# EasyEDA Pro project ProProject_ESP32-Gateway_2023-11-02.epro, board PCB1
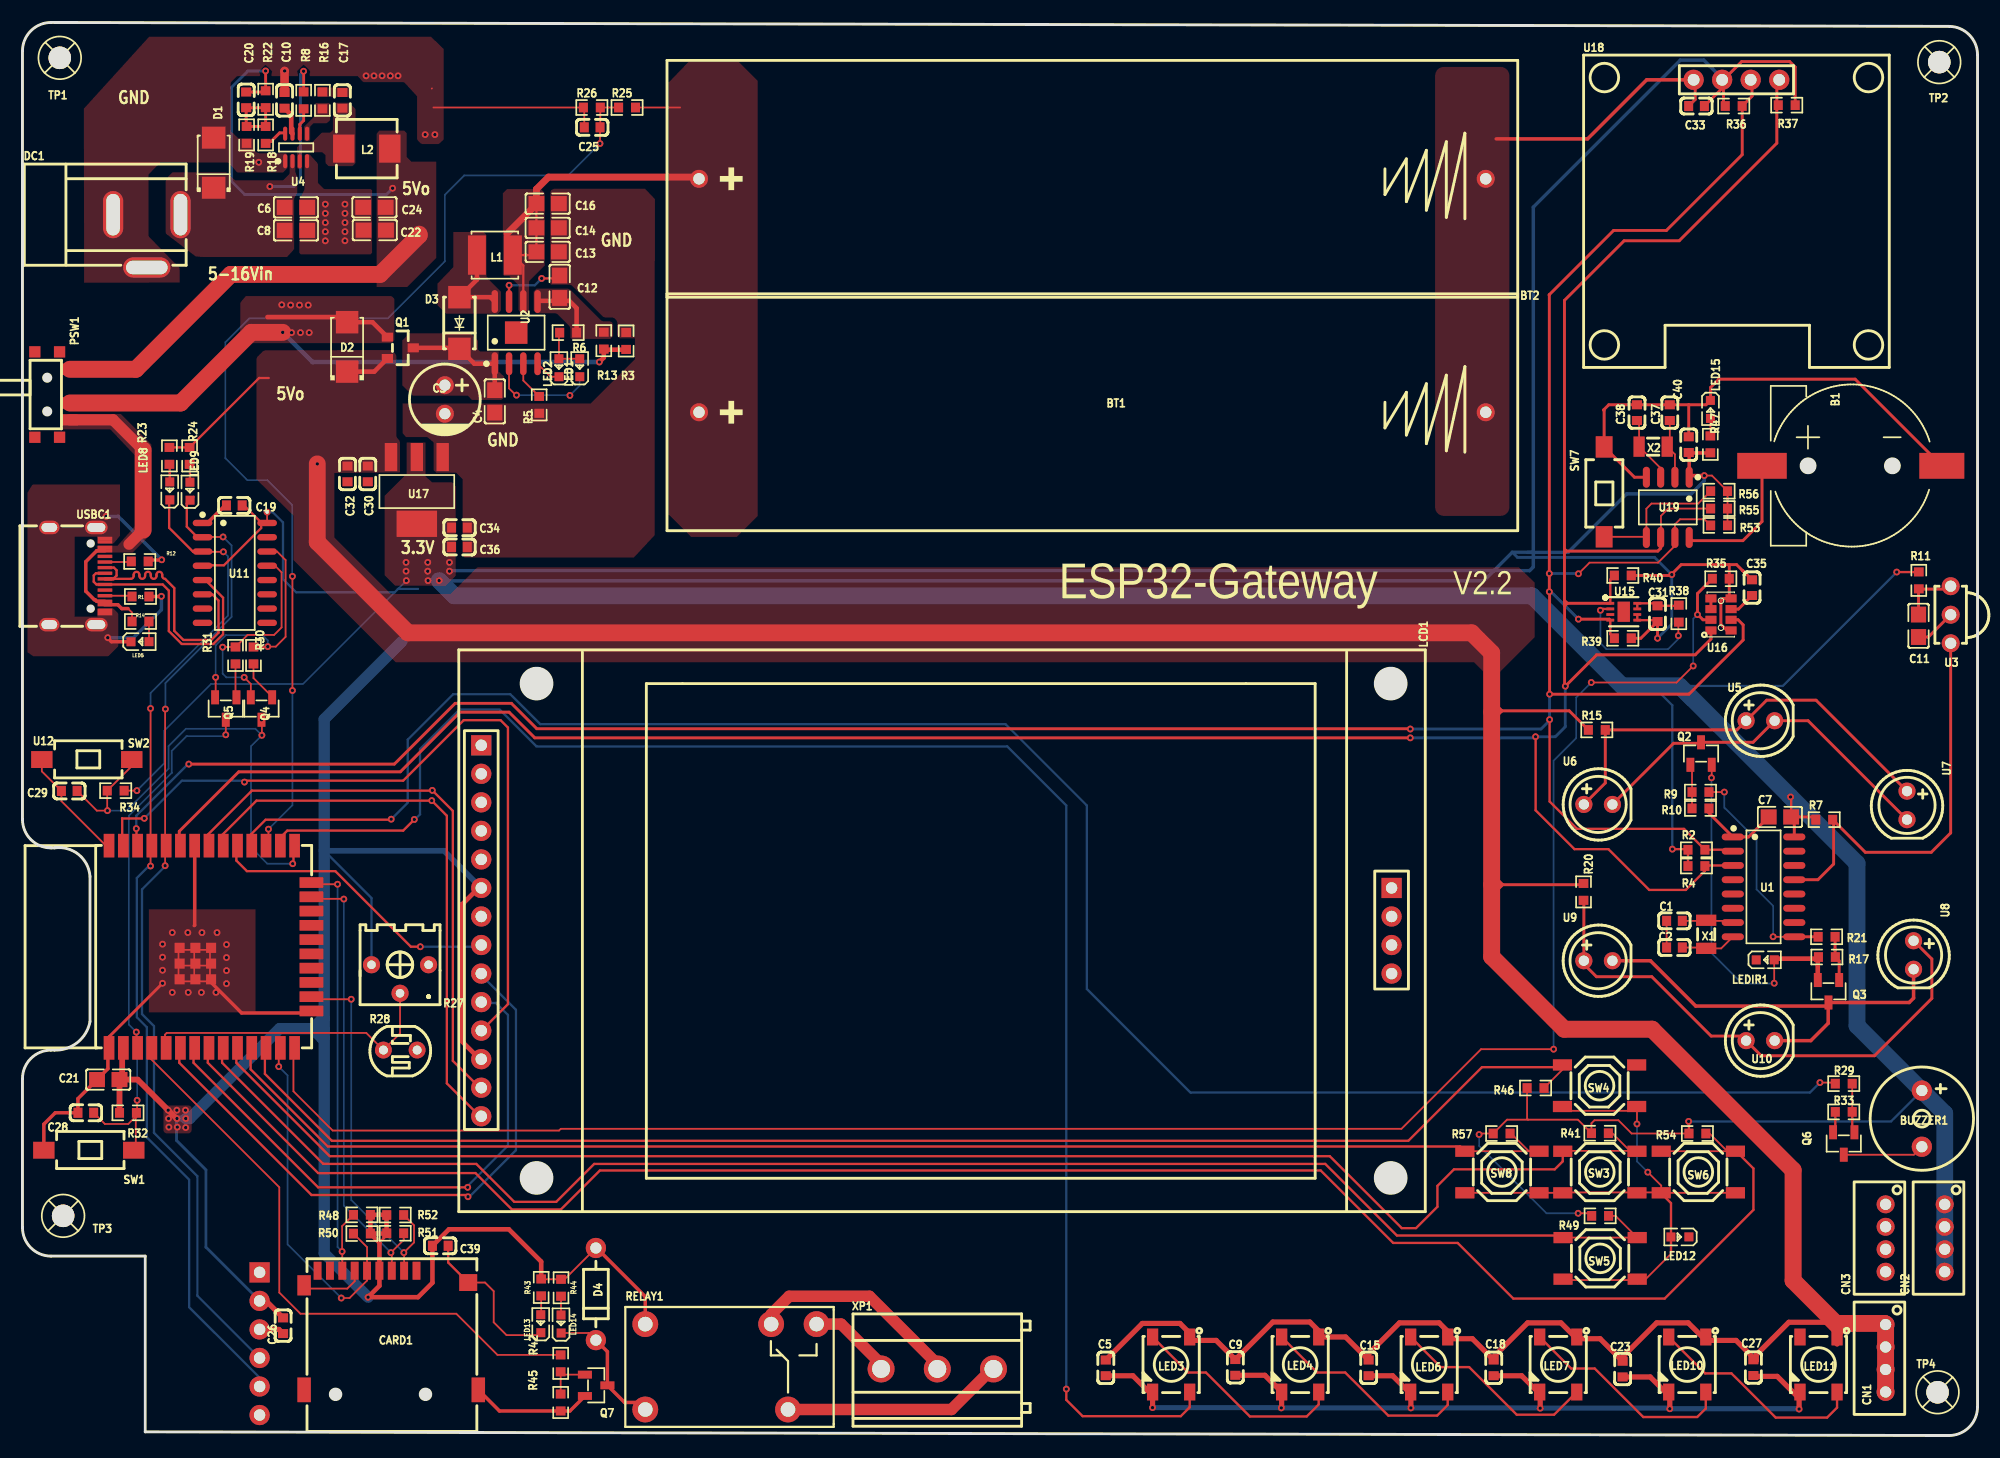
[diagram p4: board, top side]
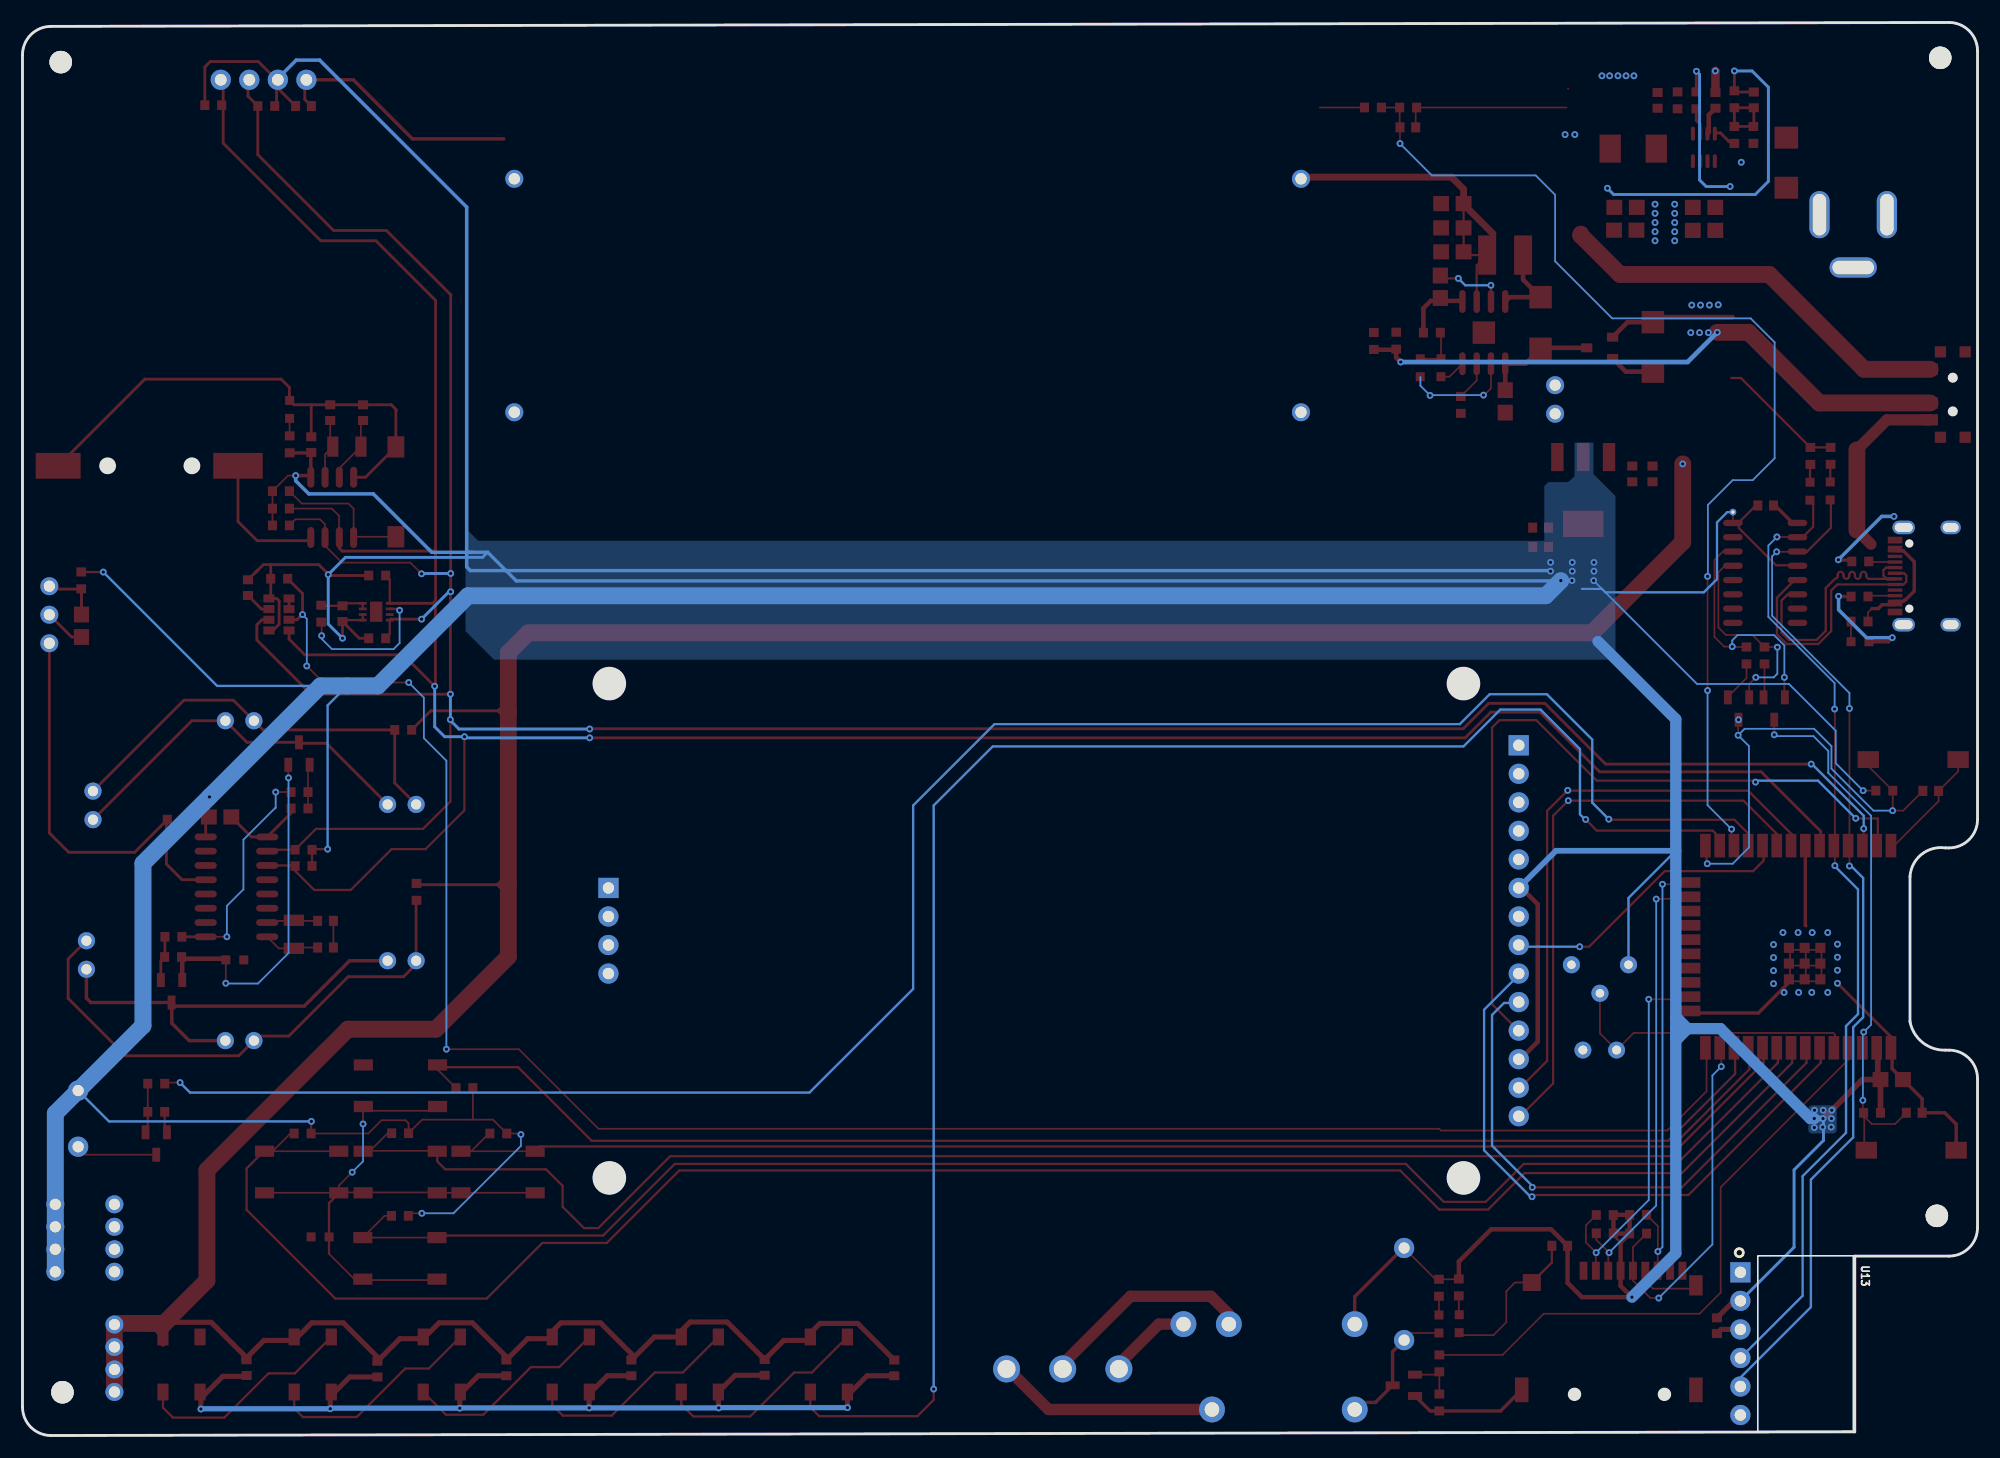
[diagram p5: board, bottom side, seen from below]

Outline 173.96 x 125.77 mm; copper layers: Top Layer, Bottom Layer. Coordinates in mm from the lower left corner of the outline.
Outline path: 0,123.23 0,54.84 arc(0.74,53.05) 2.54,52.3 2.86,52.3 arc(4.99,51.72) 6.01,49.76 6.01,36.84 arc(4.9,34.99) 2.86,34.3 2.54,34.3 arc(0.74,33.56) 0,31.76 0,18.51 arc(0.74,16.71) 2.54,15.97 10.92,15.97 10.92,0.33 171.41,0 arc(173.21,0.74) 173.96,2.54 173.96,122.89 arc(173.21,124.68) 171.42,125.43 2.54,125.77 arc(0.75,125.03) 0,123.23
Stack: Top Layer 0.035mm / Dielectric1 1.51mm FR4 er 4.5 / Bottom Layer 0.035mm

## Design rules (mm)
net USB_D-: DP1
net USB_D+: DP1
template: JLCPCB Capability(Two Layers Board)
spacing copperThickness1oz (default): track to track 0.102, other pairs 0.152 to 0.3
spacing copperThickness2oz: track to track 0.203, other pairs 0.152 to 0.3
track width copperThickness1oz (default): min 0.127, default 0.254, max 2.54
track width copperThickness2oz: min 0.203, default 0.254, max 2.54
differential pair differentialPair (default): width min 0.127, default 0.254, max 2.54; gap min 0.152, default 0.152
via viaSize (default): diameter min 0.5, default 0.61, max 10; hole min 0.3, default 0.305, max 6.3

## Placement (name value [footprint] x y rotation side)
B1  CR1220-2  [BAT-SMD_CR1220-2]  162.78 86.31 0 top
BT1  BH-18650  [BAT-TH_BH-18650-A1AJ005]  95.2 91.08 180 top
BT2  BH-18650  [BAT-TH_BH-18650-A1AJ005]  95.2 111.86 180 top
BUZZER1  HNB09A03  [BUZ-TH_BD9.0-P5.00-D0.6-FD]  169 28.2 270 top
C1  22pF  [C0603]  146.99 45.81 0 top
C2  22pF  [C0603]  146.99 43.44 0 top
C3  47uF  [CAP-TH_BD6.3-P2.50-D1.0-FD]  37.58 92.22 270 top
C4  100nF  [C0805]  42.02 92.05 90 top
C5  100nF  [C0603]  96.39 6.02 270 top
C6  22uF  [C0805]  24.33 109.32 180 top
C7  100nF  [C0805]  156.37 55.06 0 top
C8  100nF  [C0805]  24.33 107.27 180 top
C9  100nF  [C0603]  107.92 6.06 270 top
C10  0.1uF  [C0603]  23.32 118.84 90 top
C11  10uF  [C0805]  168.71 72.08 270 top
C12  10uF  [C0805]  47.8 102.25 270 top
C13  22uF  [C0805]  46.73 105.36 180 top
C14  22uF  [C0805]  46.73 107.49 180 top
C15  100nF  [C0603]  119.78 6.02 270 top
C16  100nF  [C0805]  46.73 109.65 180 top
C17  0.1uF  [C0603]  28.47 118.84 90 top
C18  100nF  [C0603]  130.9 6.02 270 top
C19  100nF  [C0603]  18.85 82.78 0 top
C20  33pF  [C0603]  19.91 118.88 270 top
C21  100nF  [C0805]  7.63 31.68 0 top
C22  22uF  [C0805]  31.35 107.29 0 top
C23  100nF  [C0603]  142.38 5.91 270 top
C24  22uF  [C0805]  31.32 109.32 0 top
C25  100nF  [C0603]  50.69 116.44 180 top
C26  4.7uF  [C0603]  23.19 9.77 270 top
C27  100nF  [C0603]  154.01 6.04 270 top
C28  100nF  [C0603]  5.63 28.73 180 top
C29  100nF  [C0603]  4.16 57.37 180 top
C30  10uF  [C0603]  30.72 85.59 90 top
C31  4.7uF  [C0603]  145.48 73.15 90 top
C32  100nF  [C0603]  28.92 85.59 90 top
C33  100nF  [C0603]  148.95 118.33 0 top
C34  10uF  [C0603]  38.88 80.81 180 top
C35  1uF  [C0603]  153.89 75.47 270 top
C36  100nF  [C0603]  38.88 79.09 180 top
C37  22pF  [C0603]  146.57 91.04 270 top
C38  22pF  [C0603]  143.65 91.04 270 top
C39  100nF  [C0603]  37.18 16.89 0 top
C40  1uF  [C0603]  148.26 88.2 90 top
CARD1  -  [TF-SMD_THD2528-11SD-GF]  32.81 9.37 0 top
CN1  B4B-PH-K-S(LF)(SN)  [CONN-TH_B4B-PH-K-S]  165.78 6.88 90 top
CN2  B4B-PH-K-S(LF)(SN)  [CONN-TH_B4B-PH-K-S]  171.04 17.58 90 top
CN3  B4B-PH-K-S(LF)(SN)  [CONN-TH_B4B-PH-K-S]  165.78 17.58 90 top
D1  SMAJ12A  [SMA_L4.4-W2.7-LS5.1-RD]  17.01 113.29 90 top
D2  -  [SMA_L4.3-W2.6-LS5.1-RD]  28.88 96.9 90 top
D3  SS34  [DO-214AC_L4.3-W2.7-LS5.3-RD]  38.88 99.02 90 top
D4  IN4148  [DO-35_BD2.0-L4.2-P8.20-D0.5-R-RD]  51.02 12.59 90 top
DC1  DC-005-2.5A-2.0  [CONN-TH_DC-005-2.5A-2.0]  11.06 106.32 0 top
L1  10uH  [IND-SMD_L4.0-W4.0]  42.03 105.07 0 top
L2  4.7uH  [IND-SMD_L5.4-W5.2_FXL0530]  30.63 114.55 0 top
LCD1  HS280S010B  [LCD-TH_HS280S010B]  81.32 44.93 270 top
LED1  XL-1608SURC-06  [LED0603-RD_RED]  49.58 95.04 90 top
LED2  XL-1608SURC-06  [LED0603-RD_RED]  47.74 95.04 90 top
LED3  WS2812C/W  [LED-SMD_4P-L5.0-W5.0-TL_WS2812B-B]  102.21 6.32 270 top
LED4  WS2812C/W  [LED-SMD_4P-L5.0-W5.0-TL_WS2812B-B]  113.69 6.32 270 top
LED5  XL-1608SURC-06  [LED0603-RD_RED]  10.46 70.66 0 top
LED6  WS2812C/W  [LED-SMD_4P-L5.0-W5.0-TL_WS2812B-B]  125.17 6.32 270 top
LED7  WS2812C/W  [LED-SMD_4P-L5.0-W5.0-TL_WS2812B-B]  136.65 6.32 270 top
LED8  XL-1608SURC-06  [LED0603-RD_RED]  13.11 84.08 90 top
LED9  XL-1608SURC-06  [LED0603-RD_RED]  14.91 84.05 90 top
LED10  WS2812C/W  [LED-SMD_4P-L5.0-W5.0-TL_WS2812B-B]  148.13 6.32 270 top
LED11  WS2812C/W  [LED-SMD_4P-L5.0-W5.0-TL_WS2812B-B]  159.81 6.32 270 top
LED12  XL-1608SURC-06  [LED0603-RD_RED]  147.48 17.68 180 top
LED13  XL-1608SURC-06  [LED0603-RD_RED]  46.12 9.95 90 top
LED14  19-217/GHC-YR1S2/3T  [LED0603-RD]  47.92 9.93 90 top
LED15  XL-1608SURC-06  [LED0603-RD_RED]  150.19 91.33 270 top
LEDIR1  XL-1608SURC-06  [LED0603-RD_RED]  155.07 42.34 0 top
NOREF  -  [Pad_e1716]  21.77 82.19 0 top
PSW1  SK-3296S-01-L1  [SW-SMD_3P-P1.50_L2.7-W6.6]  2.66 92.65 270 top
Q1  -  [SOT-23_L2.9-W1.3-P1.90-LS2.4-BR]  33.62 96.82 180 top
Q2  SS8050  [SOT-23-3_L2.9-W1.3-P1.90-LS2.4-BR]  149.36 60.7 270 top
Q3  SS8050  [SOT-23-3_L2.9-W1.3-P1.90-LS2.4-BR]  160.69 39.54 90 top
Q4  SS8050  [SOT-23-3_L2.9-W1.3-P1.90-LS2.4-BR]  21.27 64.71 90 top
Q5  SS8050  [SOT-23-3_L2.9-W1.3-P1.90-LS2.4-BR]  18.09 64.71 90 top
Q6  SS8050  [SOT-23-3_L2.9-W1.3-P1.90-LS2.4-BR]  162.06 25.99 90 top
Q7  SS8050  [SOT-23-3_L2.9-W1.3-P1.90-LS2.4-BR]  51.05 4.47 180 top
R1  5.1kΩ  [R0603]  10.5 74.68 0 top
R2  10kΩ  [R0603]  148.95 52.14 180 top
R3  100k  [R0603]  53.71 97.43 270 top
R4  10kΩ  [R0603]  148.95 50.69 180 top
R5  1.1kΩ  [R0603]  45.98 91.74 90 top
R6  1kΩ  [R0603]  48.55 98.17 180 top
R7  10k  [R0603]  160.32 54.82 0 top
R8  100K  [R0603]  25.02 118.84 270 top
R9  1kΩ  [R0603]  149.31 57.27 180 top
R10  10kΩ  [R0603]  149.31 55.82 180 top
R11  100Ω  [R0603]  168.73 76.12 270 top
R12  5.1kΩ  [R0603]  10.43 77.8 0 top
R13  0Ω  [R0603]  51.73 97.45 90 top
R14  1kΩ  [R0603]  10.5 72.45 180 top
R15  100Ω  [R0603]  140.08 62.81 0 top
R16  10R  [R0603]  26.69 118.84 90 top
R17  10kΩ  [R0603]  160.55 42.59 0 top
R18  20K  [R0603]  21.64 115.77 270 top
R19  7.5K  [R0603]  19.94 115.77 90 top
R20  100Ω  [R0603]  138.9 48.39 270 top
R21  1kΩ  [R0603]  160.53 44.39 0 top
R22  40.2K  [R0603]  21.64 118.94 90 top
R23  1kΩ  [R0603]  13.07 87.2 90 top
R24  1kΩ  [R0603]  14.87 87.19 90 top
R25  1MΩ  [R0603]  53.79 118.2 0 top
R26  2MΩ  [R0603]  50.66 118.2 0 top
R27  10kΩ  [RES-ADJ-TH_3362P]  33.6 40.64 180 top
R28  GL5506(4-7K)  [RES-TH_L5.1-W4.3-P3.00-D0.5]  33.61 34.31 0 top
R29  1KΩ  [R0603]  162.06 31.32 180 top
R30  10kΩ  [R0603]  20.55 69.43 90 top
R31  10kΩ  [R0603]  18.95 69.43 90 top
R32  10kΩ  [R0603]  9.39 28.72 180 top
R33  10kΩ  [R0603]  162.06 28.81 180 top
R34  10kΩ  [R0603]  8.29 57.4 0 top
R35  10kΩ  [R0603]  151.11 76.26 0 top
R36  10kΩ  [R0603]  152.26 118.34 180 top
R37  10kΩ  [R0603]  156.98 118.41 0 top
R38  10kΩ  [R0603]  147.38 73.15 270 top
R39  10kΩ  [R0603]  142.4 70.96 180 top
R40  10kΩ  [R0603]  142.4 76.55 180 top
R41  10KΩ  [R0603]  140.36 26.91 0 top
R42  1kΩ  [R0603]  47.89 6.42 90 top
R43  1kΩ  [R0603]  47.92 13.15 90 top
R44  1kΩ  [R0603]  46.15 13.18 270 top
R45  10kΩ  [R0603]  47.89 2.94 270 top
R46  10KΩ  [R0603]  134.63 30.93 0 top
R47  1KΩ  [R0603]  150.18 88.22 270 top
R48  10k  [R0603]  30.2 19.64 180 top
R49  10KΩ  [R0603]  140.38 19.55 0 top
R50  10k  [R0603]  30.2 17.98 180 top
R51  10k  [R0603]  33.16 18 0 top
R52  10k  [R0603]  33.16 19.63 0 top
R53  10kΩ  [R0603]  150.96 81.01 180 top
R54  10KΩ  [R0603]  149.03 26.88 0 top
R55  10kΩ  [R0603]  150.96 82.51 180 top
R56  10kΩ  [R0603]  150.96 84.06 180 top
R57  10KΩ  [R0603]  131.61 26.88 0 top
RELAY1  HF32F/012-ZS3  [RELAY-TH_HF32F-012-ZS3]  63.04 6.12 0 top
SW1  TS-1101-C-W  [SW-SMD_L6.0-W3.3-LS8.0]  5.9 25.4 180 top
SW2  TS-1101-C-W  [SW-SMD_L6.0-W3.3-LS8.0]  5.72 60.17 180 top
SW3  TS-1187A-B-A-B  [SW-SMD_4P-L5.1-W5.1-P3.70-LS6.5-TL-2]  140.35 23.45 0 top
SW4  TS-1187A-B-A-B  [SW-SMD_4P-L5.1-W5.1-P3.70-LS6.5-TL-2]  140.33 31.14 0 top
SW5  TS-1187A-B-A-B  [SW-SMD_4P-L5.1-W5.1-P3.70-LS6.5-TL-2]  140.38 15.77 0 top
SW6  TS-1187A-B-A-B  [SW-SMD_4P-L5.1-W5.1-P3.70-LS6.5-TL-2]  149.11 23.45 0 top
SW7  TS-1101-C-W  [SW-SMD_L6.0-W3.3-LS8.0]  140.73 83.99 90 top
SW8  TS-1187A-B-A-B  [SW-SMD_4P-L5.1-W5.1-P3.70-LS6.5-TL-2]  131.64 23.45 0 top
TP1  -  [M2螺丝]  3.32 122.63 0 top
TP2  -  [M2螺丝]  170.55 122.25 0 top
TP3  -  [M2螺丝]  3.62 19.55 0 top
TP4  -  [M2螺丝]  170.4 3.85 0 top
U1  IRTM1  [SOIC-16_L9.9-W3.9-P1.27-LS6.0-BL]  154.92 48.84 270 top
U2  TP5400  [SOIC-8_L5.0-W4.0-P1.27-LS6.0-BL-EP2.0]  43.93 98.17 0 top
U3  BRM-2508  [SENSOR-TG_TSOP38236]  171.57 73.06 90 top
U4  MP2315  [SOT-23-8_L3.0-W1.7-P0.65-LS2.8-BR]  24.35 114.65 270 top
U5  IR333-A  [LED-TH_BD6.2-P2.54-FD]  154.64 63.62 0 top
U6  IR333-A  [LED-TH_BD6.2-P2.54-FD]  140.2 56.17 0 top
U7  IR333-A  [LED-TH_BD6.2-P2.54-FD]  167.68 56.09 270 top
U8  IR333-A  [LED-TH_BD6.2-P2.54-FD]  168.27 42.77 270 top
U9  IR333-A  [LED-TH_BD6.2-P2.54-FD]  140.2 42.26 0 top
U10  IR333-A  [LED-TH_BD6.2-P2.54-FD]  154.64 35.15 0 top
U11  CH340C  [SOP-16_L10.0-W3.9-P1.27-LS6.0-BL]  18.89 76.78 270 top
U12  ESP32-WROOM-32E-N8  [WIFI-SMD_ESP32-WROOM-32E]  16.7 43.51 0 top
U13  1*6Pin  [CONN-TH_6P-P2.54_DEALON_DW254W-11-06-85]  21.1 8.17 270 bottom
U15  SHT30-DIS-B10KS  [DFN-8_L2.5-W2.5-P0.50-BL-EP]  142.48 73.33 270 top
U16  -  [SENSOR-SMD_L3.9-W2.4-P0.95-BL]  151.13 73.08 0 top
U17  AMS1117-3.3  [SOT-223-3_L6.5-W3.4-P2.30-LS7.0-BR]  35.09 84.12 90 top
U18  OLED Panel  [OLED-TH_L27.8-W27.2-P2.54_C9900033791]  152.5 120.67 0 top
U19  DS1302ZM  [SOP-8_L4.9-W3.9-P1.27-LS6.0-BL]  146.4 82.62 180 top
USBC1  TYPE-C-31-M-12  [USB-C_SMD-TYPE-C-31-M-12]  4.86 76.5 270 top
X1  22.1184kHz  [FC-135R_L3.2-W1.5]  149.81 44.61 90 top
X2  32.768kHz  [FC-135R_L3.2-W1.5]  145.09 88.02 0 top
XP1  KF128L-5.0-3P  [CONN-TH_3P-P5.00_KF128L-5.0-3P]  81.4 5.93 0 top

## Footprints (pads in the part's own frame, mm; a bottom-side part is the same pattern mirrored in y, then rotated)
BAT-SMD_CR1220-2
  rect 4.4x2.3 smd: 1(-8,0)
  rect 4x2.3 smd: 2(8,0)
BAT-TH_BH-18650-A1AJ005
  round 1.6 hole 1.02: 1(-35,0) 2(35,0)
BUZ-TH_BD9.0-P5.00-D0.6-FD
  round 1.8 hole 1: 1(-2.5,0) 2(2.5,0)
C0603
  rect 0.8x0.9 smd: 1(-0.7,0) 2(0.7,0)
C0805
  rect 1.41x1.35 smd: 1(-1,0) 2(1,0)
CAP-TH_BD6.3-P2.50-D1.0-FD
  round 1.6 hole 1: 1(-1.27,0) 2(1.27,0)
CONN-TH_3P-P5.00_KF128L-5.0-3P
  round 2.4 hole 1.6: 1(-5,0) 2(0,0) 3(5,0)
CONN-TH_6P-P2.54_DEALON_DW254W-11-06-85
  rect 1.8x1.8 hole 1.02: 1(-6.35,0)
  round 1.8 hole 1.02: 2(-3.81,0) 3(-1.27,0) 4(1.27,0) 5(3.81,0) 6(6.35,0)
CONN-TH_B4B-PH-K-S
  round 1.6 hole 1: 1(3,0) 2(1,0) 3(-1,0) 4(-3,0)
CONN-TH_DC-005-2.5A-2.0
  oval 1.8x4.2 hole 1.2x3.7: 1(2.999,2.35) 2(-2.999,2.35)
  oval 4.2x1.8 hole 3.7x1.2: 3(0,-2.35)
DFN-8_L2.5-W2.5-P0.50-BL-EP
  rect 0.25x0.7 smd: 1(-0.75,-1.2) 2(-0.25,-1.2) 3(0.25,-1.2) 4(0.75,-1.2) 5(0.75,1.2) 6(0.25,1.2) 7(-0.25,1.2) 8(-0.75,1.2)
  rect 1.8x1.1 smd: 9(0,0)
DO-35_BD2.0-L4.2-P8.20-D0.5-R-RD
  round 1.8 hole 1: 1(4.1,0) 2(-4.1,0)
DO-214AC_L4.3-W2.7-LS5.3-RD
  rect 2x2 smd: 1(-2.3,0) 2(2.3,0)
FC-135R_L3.2-W1.5
  rect 1x1.8 smd: 1(-1.25,0) 2(1.25,0)
IND-SMD_L4.0-W4.0
  rect 1.6x3.5 smd: 1(-1.6,0) 2(1.6,0)
IND-SMD_L5.4-W5.2_FXL0530
  rect 1.9x2.5 smd: 1(-2.05,0) 2(2.05,0)
LCD-TH_HS280S010B
  rect 1.8x1.8 hole 1.02: 1(-16.51,-40.5) 15(-3.81,40.5)
  round 1.8 hole 1.02: 2(-13.97,-40.5) 3(-11.43,-40.5) 4(-8.89,-40.5) 5(-6.35,-40.5) 6(-3.81,-40.5) 7(-1.27,-40.5) 8(1.27,-40.5) 9(3.81,-40.5) 10(6.35,-40.5) 11(8.89,-40.5) 12(11.43,-40.5) 13(13.97,-40.5) 14(16.51,-40.5) 16(-1.27,40.5) 17(1.27,40.5) 18(3.81,40.5)
LED0603-RD
  rect 0.8x0.8 smd: 1(-0.799,-0.004) 2(0.799,0.004)
LED0603-RD_RED
  rect 0.8x0.8 smd: 1(-0.799,-0.004) 2(0.799,0.004)
LED-SMD_4P-L5.0-W5.0-TL_WS2812B-B
  rect 1.5x1 smd: 1(-2.45,1.65) 2(-2.45,-1.65) 3(2.45,-1.65) 4(2.45,1.65)
LED-TH_BD6.2-P2.54-FD
  round 1.524 hole 0.914: 1(-1.27,0) 2(1.27,0)
M2螺丝
  round 2 hole 2: 1(0,0)
OLED-TH_L27.8-W27.2-P2.54_C9900033791
  round 1.8 hole 1.05: 1(-3.81,0) 2(-1.27,0) 3(1.27,0) 4(3.81,0)
Pad_e1716
  round 0.61 hole 0.305: 40(0,0)
R0603
  rect 0.807x0.864 smd: 1(-0.754,0) 2(0.754,0)
RELAY-TH_HF32F-012-ZS3
  round 2.3 hole 1.3: 1(-7.62,-3.8) 2(-7.62,3.8) 3(3.58,3.8) 4(7.62,3.8) 5(5.08,-3.8)
RES-ADJ-TH_3362P
  round 1.524 hole 0.762: 1(-2.54,-1.27) 2(0,1.27) 3(2.54,-1.27)
RES-TH_L5.1-W4.3-P3.00-D0.5
  round 1.5 hole 0.8: 1(-1.5,0) 2(1.5,0)
SENSOR-SMD_L3.9-W2.4-P0.95-BL
  rect 0.986x0.719 smd: 1(-0.896,-1.425) 2(-0.896,-0.475) 3(-0.896,0.475) 4(-0.896,1.425) 5(0.896,1.425) 6(0.896,0.475) 7(0.896,-0.475) 8(0.896,-1.425)
SENSOR-TG_TSOP38236
  round 1.6 hole 1: 1(-2.54,0) 2(0,0) 3(2.54,0)
SMA_L4.3-W2.6-LS5.1-RD
  rect 1.999x1.999 smd: 1(-2.2,0) 2(2.2,0)
SMA_L4.4-W2.7-LS5.1-RD
  rect 1.96x2.1 smd: 1(-2.23,0) 2(2.23,0)
SOIC-8_L5.0-W4.0-P1.27-LS6.0-BL-EP2.0
  oval 0.574x2.038 smd: 1(-1.905,-2.769) 2(-0.635,-2.769) 3(0.635,-2.769) 4(1.905,-2.769) 5(1.905,2.769) 6(0.635,2.769) 7(-0.635,2.769) 8(-1.905,2.769)
  rect 2x2 smd: 9(0,0)
SOIC-16_L9.9-W3.9-P1.27-LS6.0-BL
  oval 0.602x1.971 smd: 1(-4.445,-2.736) 2(-3.175,-2.736) 3(-1.905,-2.736) 4(-0.635,-2.736) 5(0.635,-2.736) 6(1.905,-2.736) 7(3.175,-2.736) 8(4.445,-2.736) 9(4.445,2.736) 10(3.175,2.736) 11(1.905,2.736) 12(0.635,2.736) 13(-0.635,2.736) 14(-1.905,2.736) 15(-3.175,2.736) 16(-4.445,2.736)
SOP-8_L4.9-W3.9-P1.27-LS6.0-BL
  oval 0.63x1.865 smd: 1(-1.905,-2.683) 2(-0.635,-2.683) 3(0.635,-2.683) 4(1.905,-2.683) 5(1.905,2.683) 6(0.635,2.683) 7(-0.635,2.683) 8(-1.905,2.683)
SOP-16_L10.0-W3.9-P1.27-LS6.0-BL
  oval 0.56x1.745 smd: 1(-4.445,-2.873) 2(-3.175,-2.873) 3(-1.905,-2.873) 4(-0.635,-2.873) 5(0.635,-2.873) 6(1.905,-2.873) 7(3.175,-2.873) 8(4.445,-2.873) 9(4.445,2.873) 10(3.175,2.873) 11(1.905,2.873) 12(0.635,2.873) 13(-0.635,2.873) 14(-1.905,2.873) 15(-3.175,2.873) 16(-4.445,2.873)
SOT-23-3_L2.9-W1.3-P1.90-LS2.4-BR
  rect 1.25x0.7 smd: 1(1,-0.95) 2(1,0.95) 3(-1,0)
SOT-23-8_L3.0-W1.7-P0.65-LS2.8-BR
  oval 1.252x0.364 smd: 1(1.226,-0.975) 2(1.226,-0.325) 3(1.226,0.325) 4(1.226,0.975) 5(-1.226,0.975) 6(-1.226,0.325) 7(-1.226,-0.325) 8(-1.226,-0.975)
SOT-23_L2.9-W1.3-P1.90-LS2.4-BR
  rect 1.001x0.8 smd: 1(1.151,-0.95) 2(1.151,0.95) 3(-1.151,0)
SOT-223-3_L6.5-W3.4-P2.30-LS7.0-BR
  rect 2.5x1.1 smd: 1(2.97,-2.3) 2(2.97,0) 3(2.97,2.3)
  rect 2.34x3.6 smd: 4(-2.97,0)
SW-SMD_3P-P1.50_L2.7-W6.6
  rect 1x1 smd: 0(-3.8,0.641) 0(-3.8,-1.559) 0(3.8,0.641) 0(3.8,-1.559)
  rect 1x1.4 smd: 1(-2.25,1.559) 2(0.75,1.559) 3(2.25,1.559)
SW-SMD_4P-L5.1-W5.1-P3.70-LS6.5-TL-2
  rect 1.7x1 smd: 1(-3.3,1.85) 2(3.3,1.85) 3(-3.3,-1.85) 4(3.3,-1.85)
SW-SMD_L6.0-W3.3-LS8.0
  rect 1.9x1.5 smd: 1(-4,0) 2(4,0)
TF-SMD_THD2528-11SD-GF
  rect 0.701x1.6 smd: 1(2.251,5.301) 2(1.151,5.301) 3(0.051,5.301) 4(-1.049,5.301) 5(-2.149,5.301) 6(-3.248,5.301) 7(-4.351,5.301) 8(-5.451,5.301) 9(-6.551,5.301)
  rect 1.199x1.801 smd: 10(-7.75,4)
  rect 1.199x2.2 smd: 11(-7.75,-5.301) 12(7.75,-5.301)
  rect 1.6x1.501 smd: 13(6.851,4.25)
USB-C_SMD-TYPE-C-31-M-12
  oval 1.2x2 hole 0.8x1.6: 0(-4.325,1.706) 1(4.325,1.706)
  oval 1.2x1.8 hole 0.8x1.4: 2(4.325,-2.474) 3(-4.325,-2.474)
  rect 0.3x1.3 smd: A1(-3.35,2.474) A4(-2.55,2.474) A5(-1.25,2.474) A6(-0.25,2.474) A7(0.25,2.474) A8(1.25,2.474) A9(2.55,2.474) A12(3.35,2.474) B1(3.05,2.474) B4(2.25,2.474) B5(1.75,2.474) B6(0.75,2.474) B7(-0.75,2.474) B8(-1.75,2.474) B9(-2.25,2.474) B12(-3.05,2.474)
WIFI-SMD_ESP32-WROOM-32E
  rect 0.95x2.1 smd: 1(-9.002,-9) 2(-7.732,-9) 3(-6.463,-9) 4(-5.192,-9) 5(-3.922,-9) 6(-2.652,-9) 7(-1.383,-9) 8(-0.113,-9) 9(1.157,-9) 10(2.428,-9) 11(3.697,-9) 12(4.968,-9) 13(6.237,-9) 14(7.508,-9) 25(7.508,9) 26(6.237,9) 27(4.968,9) 28(3.697,9) 29(2.428,9) 30(1.157,9) 31(-0.113,9) 32(-1.383,9) 33(-2.652,9) 34(-3.922,9) 35(-5.192,9) 36(-6.463,9) 37(-7.732,9) 38(-9.002,9)
  rect 2.1x0.95 smd: 15(9.002,-5.715) 16(9.002,-4.445) 17(9.002,-3.175) 18(9.002,-1.905) 19(9.002,-0.635) 20(9.002,0.635) 21(9.002,1.905) 22(9.002,3.175) 23(9.002,4.445) 24(9.002,5.715)
  rect 0.9x0.9 smd: 39(-2.721,-0.1) 39(-2.721,-1.5) 39(-2.721,-2.9) 39(-1.321,-0.1) 39(-1.321,-1.5) 39(-1.321,-2.9) 39(0.079,-0.1) 39(0.079,-1.5) 39(0.079,-2.9)

## Nets
As in the schematic, except:
3.3V: BUZZER1.1 C7.2 C19.2 C21.2 C26.1 C31.1 C33.2 C34.2 C35.1 C36.2 C39.1 C40.1 CARD1.4 CN2.1 CN2.2 CN2.3 CN2.4 D4.1 LCD1.6 LCD1.12 NOREF.40 R2.2 R4.2 R7.1 R11.1 R27.3 R32.2 R34.2 R35.2 R36.2 R37.2 R39.1 R40.1 R41.1 R43.2 R44.1 R46.1 R47.2 R48.1 R49.1 R50.1 R51.1 R52.1 R53.1 R54.1 R55.1 R56.1 R57.1 RELAY1.2 U1.16 U11.4 U11.16 U12.2 U13.2 U15.5 U15.6 U16.5 U16.8 U17.2 U17.4 U18.2 U19.1

Pads without a net: CARD1 1 8 9; LCD1 1 2 3 4 5 15 16 17 18; LED11 2; PSW1 0; R27 1; TP1 1; TP2 1; TP3 1; TP4 1; U1 4 5 6 10 11 12 14 15; U11 7 8 9 10 11 12 15; U12 17 18 19 20 21 22; U13 1 6; U15 3; USBC1 A8 B8

## Via types
v1: diameter 0.61, hole 0.305, Top Layer to Bottom Layer, 156 vias

## Routing (per net, layer and track width the routed paths; a pad name or vN(x,y) marks a point on that pad's centre or on a via; arc(x,y) is an arc through that point)
3.3V: length 905
  Top Layer w0.152: 21.77,82.11 U11.16 ; R44.1 46.18,13.91 R43.2 48.23,13.91 D4.1 ; 148.28,26.88 143.18,26.88 142,28.06 139.87,28.06 139.6,27.8 R41.1 138.4,28.11 133.96,28.11 ; R34.2 v1(10.18,57.4) ; 133.96,28.11 132.09,28.11 R57.1 129.7,26.88 v1(129.61,26.79) ; 133.96,28.11 133.88,28.19 R46.1 ; v1(138.42,19.78) 139.39,19.78 R49.1 ; R53.1 R55.1 R56.1 150.33,85.44 v1(149.65,85.44) ; 32.4,19.64 R52.1
  Top Layer w0.2: 15.79,77.46 17.92,77.46 21.24,80.77 21.24,81.27 19.72,82.78 C19.2
  Top Layer w0.203: R51.1 32.41,17.83 31.76,17.17 ; C7.2 157.37,56.79 v1(157.32,56.84) ; 148.28,26.88 148.28,27.93 v1(148.25,27.96) ; C31.1 145.36,72.58 U15.5 U15.6 ; R4.2 R2.2 148.14,52.19 v1(146.8,52.19) ; R11.1 168.72,76.86 v1(166.77,76.86)
  Top Layer w0.254: 151.35,120.03 151.38,120.06 151.38,120.62 ; 151.35,120.03 C33.2 ; 151.35,120.03 151.35,120.67 152.98,122.3 157.24,122.3 157.73,121.81 R37.2 ; 151.35,120.03 151.35,118.5 R36.2 ; 151.84,77.52 147.59,77.52 146.75,76.68 v1(146.75,76.63) 146.68,76.55 R40.1 ; 151.84,77.52 151.87,77.49 R35.2 151.87,74.67 U16.5 151.34,74.51 151.12,74.29 151.12,72.21 151.67,71.66 152.03,71.66 ; 151.84,77.52 152.52,77.52 153.06,76.97 ; R7.1 159.32,55.06 C7.2 157.65,54.78 U1.16 ; 153.06,76.97 153.09,76.97 C35.1 ; 153.06,76.97 153.26,76.78 ; v1(145.48,70.96) C31.1 144,70.96 R39.1
  Top Layer w0.305: 21.3,81.21 21.24,81.27 ; 148.3,87.46 U19.1 148.45,85.44 v1(149.65,85.44) ; 148.3,87.46 150.17,87.46 R47.2 ; 148.3,87.46 C40.1 ; 51.75,16.69 D4.1 ; RELAY1.2 55.42,12.36 51.15,16.63
  Top Layer w0.4: R50.1 32.38,17.98 R51.1 32.4,18.02 32.4,19.64 R48.1 R50.1 ; R50.1 31.76,17.17 CARD1.4 31.76,13.32 v1(30.75,12.31) 35.2,12.31 36.48,13.6 C39.1 37.95,18.36 43.27,18.36 46.15,15.48 R44.1
  Top Layer w0.406: 40.76,48.66 40.5,48.66 39.13,47.29 39.13,35.05 40.76,33.42
  Top Layer w0.457: U13.2 21.68,11.98 C26.1
  Top Layer w0.508: 13.71,28.21 v1(12.97,28.96) 10.24,31.68 C21.2 ; C21.2 8.87,31.92 8.87,34.33 ; C21.2 R32.2
  Bottom Layer w0.152: 33.42,75.36 v1(34.16,76.09) ; v1(129.61,26.79) 129.61,25.78 135.6,19.78 v1(138.42,19.78) ; v1(10.18,57.4) 12.62,59.84 12.62,62.73 16.78,66.9 24.96,66.9 33.11,75.05
  Bottom Layer w0.2: NOREF.40 22.27,82.19 23.18,81.28 23.18,76.22 24.35,75.05 33.11,75.05 33.42,75.36 35.19,75.36 ; R27.3 31.06,47.84 26.85,52.05
  Bottom Layer w0.203: v1(166.77,76.86) 156.63,66.72 147.44,66.72 ; BUZZER1.1 166.26,27.96 v1(148.25,27.96) ; 145.07,66.72 146.8,64.99 v1(146.8,52.19)
  Bottom Layer w0.254: v1(145.48,70.96) 146.75,72.23 v1(146.75,76.63) 145.21,78.17 133.02,78.17 132.56,78.62 ; 13.71,28.21 13.71,26.26 16.32,23.64 16.32,16.76 U13.2
  Bottom Layer w0.305: 130.93,76.98 132.56,78.62 134.43,78.62 ; 130.93,76.98 130.01,76.07 38.02,76.07 ; 130.93,76.98 38.02,76.98 ; 130.93,76.98 134.1,76.98 134.43,77.31 134.43,78.61 ; 134.43,78.61 137.53,78.61 142.74,83.82 148.48,83.82 149.65,84.98 v1(149.65,85.44) ; 134.43,78.61 133.93,78.61 ; 134.43,78.61 134.43,78.62 ; 134.43,78.62 134.43,109.34 147.51,122.42 149.6,122.42 151.35,120.67
  Bottom Layer w0.5: 26.85,52.05 37.51,52.05 LCD1.6
  Bottom Layer w0.508: 13.71,28.21 v1(14.52,28.21)
  Bottom Layer w1: 25.8,36.22 26.7,37.12 26.85,37.12 ; 25.8,36.22 26.64,35.37 26.85,35.37 ; 25.8,36.22 26.85,36.22 ; 25.8,36.22 22.88,36.22 14.88,28.21 v1(14.52,28.21) ; 26.85,37.12 26.85,63.76 33.77,70.68 ; 26.85,37.12 26.85,36.22 ; 26.85,36.22 26.85,35.37 ; 26.85,35.37 26.85,16.22 v1(30.75,12.31)
  Bottom Layer w1.5: v1(37.08,76.09) 38.42,74.75 134.31,74.75 142.33,66.72 147.44,66.72 v1(157.32,56.84) 163.24,50.92 163.24,36.47 BUZZER1.1 171.04,28.67 CN2.1 CN2.2 CN2.3 CN2.4
  vias: v1(13,28.21) v1(13.02,27.45) v1(13.73,28.96) v1(13.75,28.21) v1(13.77,27.45) v1(14.5,28.96) v1(14.52,27.41) v1(34.13,77.72) v1(34.13,76.93) v1(36.06,77.72) v1(36.06,76.93) v1(36.08,76.09) v1(37.99,77.72) v1(37.99,76.93)
5V: length 324.4
  Top Layer w0.2: 21.91,94.13 21.05,94.13 R24.2 14.87,87.95 R23.2
  Top Layer w0.254: 131.71,49.03 138.79,49.03 R20.1 ; 131.71,49.03 130.73,49.03 ; 131.71,49.03 131.26,48.58 131.26,48.56 ; 131.71,49.03 131.31,49.43 131.31,49.55 ; 130.5,64.18 130.82,64.5 131.64,64.5 ; 131.64,64.5 137.63,64.5 R15.1 ; 131.64,64.5 131.18,64.04 131.18,63.9 ; 131.64,64.5 131.26,64.89 131.26,64.94
  Top Layer w0.406: D2.1 31.3,94.7 Q1.2
  Top Layer w0.457: 162.55,9.98 162.55,9.91 161.46,8.82 ; C5.1 99.64,9.98 102.99,9.98 103.86,9.11 103.86,8.47 106.21,8.47 C9.1 111.26,10.1 114.55,10.1 115.34,9.31 LED4.1 117.73,8.77 C15.1 119.78,7.28 122.52,10.03 126.05,10.03 126.82,9.27 126.82,8.62 129.01,8.62 C18.1 130.9,7.01 133.93,10.03 136.89,10.03 138.3,8.62 140.37,8.62 C23.1 142.38,7 145.41,10.03 148.22,10.03 149.78,8.47 152.47,8.47 154.27,6.67 154.27,7.19 157.17,10.08 160.47,10.08 161.46,9.09 161.46,8.82 ; 161.46,8.82 161.46,8.14
  Top Layer w1.5: v1(26.23,86.48) 26.23,79.52 34.31,71.45 128.95,71.45 130.73,69.67 130.73,42.62 137.18,36.17 145,36.17 157.55,23.62 157.55,13.79 161.36,9.98 165.68,9.98 CN1.1 CN1.2 CN1.3 CN1.4
GND: length 326.1
  Top Layer w0.152: 39.66,13.62 41.16,13.62 41.93,12.85 41.93,10.08 43.07,8.94 45.91,8.94 LED13.1 ; 36.44,119.91 36.42,119.88 ; C25.2 49.99,118.12 R26.1 36.57,118.2 ; 15.28,43.23 13.88,43.23 13.88,41.83 ; 15.28,43.23 16.68,43.23 16.68,41.83 ; 15.28,43.23 15.28,41.83 ; 15.28,41.83 15.28,40.43 ; 15.28,41.83 13.88,41.83 ; 15.28,41.83 16.68,41.83 ; 15.28,40.43 13.88,40.43 13.88,41.83 ; 15.28,40.43 16.68,40.43 16.68,41.83 ; C2.1 C1.1 ; CARD1.10 25.35,13.08 28.9,13.08 29.56,13.74 CARD1.6 ; 7.6,52.33 3.46,56.46 C29.2 1.72,59.12 1.72,60.17
  Top Layer w0.203: Q6.2 161.3,27.19 161.3,29.14 ; U15.7 U15.8 145.26,74.08 C31.2 147.33,73.85 R38.1 ; v1(46.19,102.99) 47.76,102.99 48.02,103.25 ; v1(43.3,102.38) 43.29,102.38 U2.7 ; C39.2 37.88,15.4 39.66,13.62
  Top Layer w0.254: 148.84,120.62 148.84,118.92 C33.1 ; R10.1 150.06,55.4 U1.1 153.59,53.28 C7.1 ; 148.26,91.74 149.8,91.74 150.21,92.15 150.21,93.29 150.94,94.03 163.07,94.03 B1.2 ; 148.26,91.74 C37.1 C38.1 141.14,91.74 140.68,91.28 140.73,91.23 SW7.2 143.43,85.3 U19.4 ; 148.26,91.74 148.26,91.74 C40.2 ; v1(12.46,40.25) 7.7,35.49 U12.1 ; C35.2 152.68,73.56 U16.6 ; U3.2 169.59,71.08 C11.2
  Top Layer w0.305: 7.6,34.33 7.6,32.65 C21.1 4.93,29.98 C28.2 2.92,28.73 1.9,27.71 SW1.2 ; U18.1 144.52,120.67 139.26,115.41 131.13,115.41 ; 25.61,37.61 19.5,37.61 16.68,40.43 ; 11.19,77.93 12.37,77.93 v1(12.39,77.95) ; U12.32 15.32,45.43 15.28,45.39 ; v1(12.36,74.7) 12.34,74.68 11.25,74.68 ; Q7.2 48.71,2.19 R45.2 42.44,2.19 CARD1.12 ; 9.66,70.65 7.92,70.65 7.64,70.93 ; 15.55,81.21 16.43,81.21 18.09,82.86
  Top Layer w0.457: v1(112.01,2.46) 112.04,2.49 LED4.3 110.54,5.36 C9.2 ; v1(135.04,2.43) 135.04,3.67 133.39,5.32 C18.2 ; C15.2 121.91,5.32 123.54,3.7 v1(123.54,2.46) ; v1(146.57,2.38) 146.57,3.47 144.83,5.21 C23.2 ; 154.27,5.27 156.14,5.27 158.08,3.32 v1(158.08,2.36) ; U13.3 22.82,9.44 C26.2 ; C5.2 98.8,5.32 100.56,3.57 100.56,2.49 v1(100.55,2.48)
  Top Layer w0.762: C10.2 23.32,121.45 v1(23.33,121.46)
  Bottom Layer w0.203: v1(46.19,102.99) 45.58,102.38 v1(43.3,102.38)
  Bottom Layer w0.305: v1(12.39,77.95) 8.53,81.81 v1(7.43,81.81) ; v1(12.36,74.7) 12.36,73.5 9.87,71.01 v1(7.59,71.01)
  Bottom Layer w0.457: v1(100.55,2.48) 111.98,2.48 v1(112.01,2.46) v1(123.54,2.46) 135.02,2.46 v1(135.04,2.43) 146.52,2.43 v1(146.57,2.38) 158.06,2.38 v1(158.08,2.36)
  vias: v1(12.46,43.74) v1(12.46,42.57) v1(12.46,41.41) v1(13.33,44.77) v1(13.33,39.44) v1(14.71,44.77) v1(14.75,39.44) v1(15.92,39.44) v1(15.97,44.77) v1(17.21,39.44) v1(17.31,44.77) v1(18.15,43.7) v1(18.15,42.54) v1(18.15,41.38) v1(18.15,40.22) v1(21.02,113.33) v1(26.95,109.6) v1(26.95,108.78) v1(26.95,107.96) v1(26.95,107.15) v1(26.95,106.34) v1(28.69,109.6) v1(28.69,108.79) v1(28.69,107.97) v1(28.69,107.15) v1(28.69,106.34) v1(30.57,121.03) v1(31.28,121.03) v1(32,121.03) v1(32.73,121.03) v1(33.42,121.03) v1(35.83,115.79) v1(36.69,115.79)
VIN_5V: length 66
  Top Layer w0.406: v1(51.33,95.55) 51.73,95.95 51.73,96.65 ; 51.73,96.65 51.73,96.85 ; 51.73,96.65 53.69,96.65 R3.2 ; 29.02,98.6 28.07,99.55 21.8,99.55 ; Q1.1 31.14,99.1 D2.2
  Top Layer w1.5: v1(23.16,98.19) 20.36,98.19 14.08,91.9 PSW1.2
  Bottom Layer w0.406: v1(23.16,98.19) 25.8,95.55 v1(51.33,95.55)
  vias: v1(23.07,100.64) v1(23.86,100.62) v1(23.94,98.17) v1(24.65,100.62) v1(24.74,98.17) v1(25.43,100.62) v1(25.51,98.17)
$B1_1: length 12.3
  Top Layer w0.254: B1.1 154.78,81.35 153.08,79.65 148.59,79.65 U19.8
$BUZZER1_2: length 7.2
  Top Layer w0.152: BUZZER1.2 168.29,24.99 Q6.3
$C1_2: length 4.6
  Top Layer w0.152: U1.7 152.03,45.81 C1.2
  Top Layer w0.305: 149.76,45.81 X1.2
$C2_2: length 5.7
  Top Layer w0.152: X1.1 149.74,43.44 C2.2 ; X1.1 149.02,43.36 ; X1.1 151.15,43.36 U1.8
$C3_1: length 10.2
  Top Layer w0.406: C4.2 U2.1 40.2,95.4 D3.1 38.79,96.82 Q1.3
$C6_2: length 14.6
  Top Layer w0.254: R8.1 25.02,121.42 v1(25.01,121.43)
  Bottom Layer w0.254: v1(25.01,121.43) 24.73,121.15 24.73,111.76 24.15,111.17 v1(22.01,111.17)
$C10_1: length 2.6
  Top Layer w0.406: C10.1 23.91,117.55 23.91,115.99 U4.7
$C11_1: length 5.3
  Top Layer w0.254: 168.71,75.34 171.31,75.34 171.57,75.6 ; 168.71,75.34 C11.1 ; 168.71,75.34 R11.2
$C12_2: length 6
  Top Layer w0.152: 51.66,98.29 51.73,98.36
  Top Layer w0.406: U2.5 45.89,101 48.65,101 49.3,100.34 R6.1
$C20_2: length 6.8
  Top Layer w0.254: R22.1 21.63,118.18 C20.2 19.91,116.56 R19.2 R18.1 R22.1
$C37_2: length 5.4
  Top Layer w0.152: U19.2 147.03,87.33 X2.2 146.57,88.25 C37.2
$C38_2: length 5.9
  Top Layer w0.152: U19.3 145.76,86.1 X2.1 143.84,90.15 C38.2
$D3_2: length 7.7
  Top Layer w0.406: U2.8 41.64,101.32 D3.2 40.44,102.88 L1.1
$D4_2: length 12.1
  Top Layer w0.152: D4.2 50.38,9.13 LED14.1
  Top Layer w0.305: RELAY1.1 54.79,2.95 53.57,2.95 Q7.3 52.05,7.47 D4.2
$LED1_1: length 10
  Top Layer w0.152: v1(43.96,92.6) 43.96,92.54 43.29,93.21 U2.2
  Bottom Layer w0.152: v1(43.96,92.6) 48.68,92.6 v1(48.71,92.58) 49.57,93.44 49.57,94.23
$LED1_2: length 4.2
  Top Layer w0.152: LED1.2 LED2.2 47.73,98.05 47.85,98.17
$LED2_1: length 2.4
  Top Layer w0.152: 47.74,94.24 46.99,94.24 U2.4
$LED3_2: length 19.3
  Top Layer w0.203: LED3.2 103.72,5.61 105.3,5.61 109.21,1.7 114.27,1.7 115.34,2.77 LED4.4
$LED4_2: length 19.2
  Top Layer w0.203: LED6.4 126.82,2.72 125.87,1.77 121.53,1.77 117.7,5.61 115.2,5.61 LED4.2
$LED5_2: length 1.8
  Top Layer w0.152: 11.25,72.45 11.26,72.45 LED5.2
$LED6_2: length 18.5
  Top Layer w0.203: LED6.2 126.2,6.09 128.72,6.09 132.96,1.85 136.28,1.85 LED7.4
$LED7_2: length 19.5
  Top Layer w0.203: LED7.2 137.8,5.96 139.89,5.96 144.21,1.65 149.01,1.65 149.78,2.41 LED10.4
$LED8_2: length 1.6
  Top Layer w0.2: LED8.2 13.1,86.41 R23.1
$LED9_2: length 1.6
  Top Layer w0.2: R24.1 14.9,86.41 LED9.2
$LED10_2: length 19.7
  Top Layer w0.203: LED10.2 149.72,5.53 152.06,5.53 156,1.6 160.57,1.6 161.46,2.48 LED11.4
$LED12_2: length 55.8
  Top Layer w0.152: SW6.3 145.76,21.6 145.73,21.64 137.05,21.64 137.01,21.6 SW8.4 SW8.3 ; SW6.3 145.81,22.24 v1(144.62,23.44) ; SW6.3 152.36,21.6 ; v1(143.65,27.73) 143.65,29.26 ; SW5.4 144.42,13.92 146.68,16.18 ; 143.68,13.54 143.38,13.84 137.38,13.84 137.08,13.54 ; 137.03,28.9 143.63,28.9
  Top Layer w0.203: 143.65,29.26 SW4.4 ; 145.76,21.6 146.68,20.68 146.68,16.18
  Bottom Layer w0.152: v1(143.65,27.73) 143.65,24.4 v1(144.62,23.44)
$LED13_2: length 1.7
  Top Layer w0.152: LED13.2 46.15,10.79 R44.2
$LED14_2: length 1.7
  Top Layer w0.152: R43.1 LED14.2
$LED15_2: length 1.6
  Top Layer w0.152: R47.1 150.19,88.99 LED15.2
$LEDIR1_2: length 31.7
  Top Layer w0.152: v1(155.87,40.26) LEDIR1.2 ; Q2.2 150.31,58.57 v1(150.28,58.54)
  Top Layer w0.254: 159.75,42.54 R17.1
  Top Layer w0.406: 159.75,40.54 159.75,42.54 159.65,42.44 155.68,42.44
  Bottom Layer w0.152: v1(155.87,40.26) 155.84,40.23 153,40.23 150.28,42.95 v1(150.28,58.54)
$Q2_1: length 3.7
  Top Layer w0.152: R10.2 R9.2 148.55,59.22 148.38,59.4
$Q2_3: length 32.9
  Top Layer w0.254: U7.2 158.88,63.62 U5.2 153.98,61.7 Q2.3 149.27,61.62 146.91,61.62 U6.2
$Q3_1: length 4
  Top Layer w0.254: R21.2 161.28,42.62 R17.2 161.64,42.25 Q3.1
$Q3_3: length 37.5
  Top Layer w0.305: U9.2 144.85,42.26 148.89,38.22 160.37,38.22 ; 160.67,37.92 160.67,36.7 159.12,35.15 U10.2 ; Q3.3 167.88,38.54 168.27,38.93 U8.2
$Q4_1: length 3.7
  Top Layer w0.152: R30.1 20.55,67.42 22.22,65.76 Q4.1
$Q4_2: length 18.8
  Top Layer w0.152: v1(19.73,67.48) 20.32,66.89 Q4.2 ; v1(17.81,70.17) 17.83,70.19 R31.2 20.03,71.26 22.39,71.26 23.05,71.93 23.05,76.83 22.47,77.41 U11.13
  Bottom Layer w0.152: v1(17.81,70.17) 17.81,67.81 18.13,67.48 v1(19.73,67.48)
$Q5_1: length 3
  Top Layer w0.152: R31.1 18.95,65.79 Q5.1
$Q5_2: length 22.4
  Top Layer w0.152: v1(17.19,67.48) 17.19,65.76 Q5.2 ; U11.14 22.65,78.68 23.41,77.92 23.41,71.09 22.54,70.22 v1(21.83,70.22) 21.79,70.19 R30.2
  Bottom Layer w0.152: v1(21.83,70.22) 21.83,70.77 21.35,71.24 18.1,71.24 17.19,70.33 v1(17.19,67.48)
$Q6_1: length 4.7
  Top Layer w0.152: R33.1 R29.1
  Top Layer w0.203: Q6.1 162.81,27.19 162.81,29.14
$Q7_1: length 4.2
  Top Layer w0.152: R45.1 R42.1 48.14,5.42 Q7.1
$R1_1: length 2.4
  Top Layer w0.152: 9.75,74.83 9.66,74.75 USBC1.B5
$R5_2: length 3.5
  Top Layer w0.152: 45.98,92.49 44.56,93.9 U2.3
$R7_2: length 37.2
  Top Layer w0.254: 161.15,54.73 163.97,51.91 169.84,51.91 171.57,53.64 U3.1 ; 161.15,54.73 161.15,50.87 159.75,49.47 U1.13 ; 161.15,54.73 R7.2
$R8_2: length 2.4
  Top Layer w0.254: U4.6 24.67,116.7 25.02,117.05 R8.2
$R12_1: length 2.3
  Top Layer w0.152: USBC1.A5 9.68,77.75
$R15_2: length 38.7
  Top Layer w0.254: U6.1 140.84,58.08 R15.2 152.55,62.81 U5.1 155.19,65.45 159.59,65.45 U7.1
$R18_2: length 2.2
  Top Layer w0.254: R18.2 21.81,115.18 22.14,115.18 22.14,115.21 22.88,115.95 23.3,115.95 U4.8
$R20_2: length 47.6
  Top Layer w0.254: 168.27,44.04 169.89,42.41 169.89,38.91 164.79,33.8 154.71,33.8 U10.1 152.96,35.56 150.26,35.56 144.98,40.84 140.05,40.84 138.93,41.96 U9.1 138.93,47.33
$R38_2: length 12.8
  Top Layer w0.152: 147.31,72.35 147.34,72.32 v1(147.34,71.19)
  Top Layer w0.203: U15.2 140.68,73.58 140.56,73.45 v1(140.4,73.45)
  Bottom Layer w0.152: v1(140.4,73.45) 140.4,70.53 140.94,70 146.42,70 147.34,70.91 v1(147.34,71.19)
$R56_2: length 12.7
  Top Layer w0.152: SW7.1 144.43,79.99 U19.5 144.49,82.49 144.95,82.95 149.1,82.95 R56.2
$RELAY1_3: length 19
  Top Layer w1.016: 81.55,6.21 75.37,12.39 68.22,12.39 66.62,10.79 RELAY1.3
$RELAY1_4: length 7.4
  Top Layer w1.016: 76.55,6.21 72.84,9.92 RELAY1.4
$RELAY1_5: length 20
  Top Layer w1.016: RELAY1.5 82.66,2.32 86.55,6.21
$U16_3: length 1
  Top Layer w0.254: U16.3 U16.4
BAT: length 98.5
  Top Layer w0.152: 21.57,52.33 21.89,52.64 v1(21.89,53.97) ; 53.04,118.2 R26.2 51.42,116.47 C25.1 51.39,115 v1(51.39,114.99) ; v1(24.02,76.47) v1(24.02,66.31)
  Bottom Layer w0.152: v1(24.02,76.47) 24,76.5 24,82.82 21.78,85.03 20.01,85.03 18.05,86.99 18.05,97.3 20.19,99.44 32.5,99.44 37.58,104.52 37.58,110.43 39.31,112.16 48.55,112.16 v1(51.39,114.99) ; v1(24.02,66.31) 24.02,56.1 v1(21.89,53.97)
BAT+: length 35.1
  Top Layer w0.152: R25.2 58.51,118.2
  Top Layer w0.203: 45.73,109.59 C14.2 45.73,105.1 45.7,105.07 L1.2 44.56,104.14 U2.6
  Top Layer w0.61: 60.2,111.86 60.04,112.01 46.8,112.01 45.73,110.94 C16.2 45.73,109.59 43.11,106.97
BUZ: length 175.3
  Top Layer w0.152: R29.2 161.21,31.42 v1(159.94,31.42)
  Top Layer w0.203: 20.3,52.33 20.3,53.48 21.63,54.81 32.76,54.81 v1(32.81,54.86)
  Bottom Layer w0.203: v1(32.81,54.86) 34.28,56.33 34.28,61.95 38.32,65.98 43.4,65.98 46.07,63.32 87.47,63.32 94.71,56.08 94.71,39.75 103.93,30.53 159.05,30.53 v1(159.94,31.42)
DC_5V: length 66.7
  Top Layer w0.254: v1(21.63,121.46) 21.64,121.46 R22.2 21.53,119.58 C20.1
  Top Layer w1.5: PSW1.1 10.09,94.9 18.53,103.35 31.82,103.35 35.3,106.83 35.3,106.93
  Bottom Layer w0.254: v1(32.94,111.02) 32.38,110.46 19.78,110.46 18.61,111.63 18.61,120.01 20.06,121.46 v1(21.63,121.46)
EN: length 50.3
  Top Layer w0.152: 10.14,34.33 10.14,35.9 v1(10.13,35.91) ; 10.08,25.4 10.08,28.4 9.41,27.73 7.33,27.73 C28.1 ; 10.14,28.72 10.2,28.78 v1(10.2,29.84) ; Q5.3 v1(18.09,62.37)
  Top Layer w0.305: 10.08,28.4 10.14,28.46 10.14,28.72
  Bottom Layer w0.152: v1(10.2,29.84) 10.2,35.83 v1(10.13,35.91) 9.47,36.57 9.47,55.16 13.3,59 13.28,59.03 13.28,60.93 14.6,62.25 17.97,62.25 v1(18.09,62.37)
ESP32_RX: length 87.6
  Top Layer w0.152: v1(12.69,50.72) 12.69,64.64 v1(12.72,64.66) ; U11.2 16.05,79.98 v1(17.85,79.98)
  Top Layer w0.2: 15.21,83.54 14.62,82.95 14.62,80.89 15.54,79.98 16.05,79.98
  Bottom Layer w0.152: v1(17.85,79.98) 18.61,79.22 18.61,72.87 12.72,66.98 v1(12.72,64.66)
  Bottom Layer w0.203: U13.4 15.56,12.44 15.56,23.08 11.7,26.94 11.7,36.44 10.63,37.51 10.63,48.61 12.74,50.72
ESP32_TX: length 90.7
  Top Layer w0.152: U11.3 16.05,78.66 v1(17.87,78.66) ; v1(11.4,50.69) v1(11.4,64.71)
  Top Layer w0.2: LED8.1 13.05,83.21 13.05,80.79 15.18,78.66 16.05,78.66
  Bottom Layer w0.152: v1(17.87,78.66) 18.28,78.25 18.28,72.97 11.4,66.09 v1(11.4,64.71)
  Bottom Layer w0.203: U13.5 21.1,5.15 14.83,11.43 14.83,22.78 11.07,26.54 11.07,36.34 10.18,37.23 10.18,49.63 11.19,50.64 11.45,50.64
IO0: length 44.6
  Top Layer w0.152: v1(21.27,63.71) 21.3,63.67 v1(21.3,62.33) ; SW2.1 9.72,59.58 R34.1 7.54,55.64 v1(7.56,55.62) 6.62,55.62 C29.1
  Top Layer w0.203: 24.11,52.33 24.11,50.96 v1(24.05,50.9)
  Bottom Layer w0.152: v1(24.05,50.9) 21.78,50.9 20.34,52.34 20.34,61.36 v1(21.3,62.33) 20.72,62.91 14.54,62.91 13,61.36 13,59.36 9.26,55.62 v1(7.56,55.62)
KEY_D: length 139.7
  Top Layer w0.152: R49.2 141.74,19.55 143.68,17.62 137.08,17.62
  Top Layer w0.203: 137.08,17.62 136.89,17.8 122.29,17.8 115.92,24.18 50.87,24.18 47.49,20.8 43.76,20.8 40.38,24.18 26.76,24.18 17.76,33.18 17.76,34.33
KEY_L: length 122.6
  Top Layer w0.152: SW8.1 SW8.2 134.03,25.3 132.39,26.94
  Top Layer w0.203: SW8.1 127.92,25.73 27.17,25.73 20.3,32.59 20.3,34.33
KEY_M: length 139.6
  Top Layer w0.152: 137.05,25.34 143.65,25.34 143.02,25.34 141.48,26.88 140.99,26.88
  Top Layer w0.203: 19.03,34.33 19.03,33.18 27.34,24.86 116.32,24.86 122.72,18.46 123.99,18.46 125.9,20.37 125.9,22.22 127.37,23.69 136.34,23.69 137.05,24.41 SW3.1
KEY_R: length 169.3
  Top Layer w0.152: 145.76,25.3 152.36,25.3 151.7,25.3 150.12,26.88 R54.2
  Top Layer w0.203: 16.49,34.33 16.49,33.18 26.3,23.36 40.3,23.36 43.55,20.11 47.9,20.11 51.38,23.59 115.51,23.59 121.96,17.14 127.7,17.14 132.66,12.19 146.12,12.19 154.02,20.09 154.02,23.77 152.48,25.3 SW6.2
KEY_U: length 125.6
  Top Layer w0.152: R46.2 137.03,32.57 SW4.1
  Top Layer w0.203: 21.57,34.33 21.57,32.19 27.53,26.23 123.31,26.23 129.86,32.79 136.83,32.79 SW4.1
LUM: length 27.2
  Top Layer w0.152: 12.68,34.33 12.68,35.68 12.83,35.83 30.59,35.83 R28.1 33.6,35.79 R27.2
OLED_SCL: length 274.5
  Top Layer w0.152: R53.2 149.66,81.55 147.49,81.55 147.03,81.1 U19.7 147.03,79.2 145.53,77.69 139.44,77.69 v1(138.45,76.7)
  Top Layer w0.203: 10.14,52.33 10.14,54.01 v1(10.13,54.02) ; U15.4 141.28,71.33 R39.2 ; U1.2 152.06,52.14 R2.1 147.84,54 138.32,54 135.88,56.43 v1(135.88,63.72)
  Top Layer w0.254: v1(138.45,72.66) 141.19,72.66 U15.4 ; U16.7 152.65,72.61 153.1,72.16 153.1,70.81 148.28,65.98 v1(135.88,65.98) 135.88,75.08 v1(135.86,75.1) v1(135.86,76.73) 135.86,101.54 ; 135.83,101.52 135.86,101.54 ; 135.86,101.54 141.57,107.26 146.27,107.26 153.02,114.01 R36.1 153.89,119.21 153.89,120.67 ; v1(123.49,62.89) 123.46,62.91 45.76,62.91 43.5,65.17 38.5,65.17 33.09,59.76 v1(14.8,59.76)
  Bottom Layer w0.203: v1(14.8,59.76) 14.72,59.76 10.13,55.16 v1(10.13,54.02)
  Bottom Layer w0.254: v1(123.49,62.89) 135.12,62.89 135.88,63.65 v1(135.88,65.98) ; v1(135.86,75.1) 136.01,75.1 v1(138.45,72.66) ; v1(135.86,76.73) 138.42,76.73 v1(138.45,76.7)
OLED_SDA: length 266.8
  Top Layer w0.152: U19.6 145.79,79.96 145.79,81.86 146.44,82.51 R55.2
  Top Layer w0.203: R40.2 141.28,76.19 U15.1 ; R4.1 149.7,50.39 ; 149.7,50.39 150.06,50.74 U1.3 ; 149.7,50.39 149.7,50.26 148,48.56 144.75,48.56 141.11,52.19 138.09,52.19 134.64,55.65 134.64,62.19 v1(134.63,62.2)
  Top Layer w0.254: 13.95,52.33 13.95,53.78 19.25,59.08 33.62,59.08 38.8,64.26 38.8,64.38 43.3,64.38 45.58,62.1 v1(123.49,62.1) ; 137.2,74.33 137.2,78.53 ; 137.2,74.33 137.46,74.08 ; 137.2,74.33 137.2,74.09 137.21,74.08 ; 137.2,78.53 137.2,78.91 ; 137.2,78.53 137.39,78.72 ; U19.6 145.76,78.97 145.51,78.72 137.39,78.72 ; 137.21,73.83 137.21,66.76 v1(137.28,66.7) 140.07,69.49 148.84,69.49 150.24,70.89 150.24,71.66 ; 137.21,73.83 137.46,74.08 ; 137.21,73.83 137.21,74.08 ; 137.2,78.91 137.39,78.72 ; 137.2,78.91 137.2,101.04 142.51,106.35 147.41,106.35 156.1,115.03 156.1,120.34 156.43,120.67 ; 137.46,74.08 U15.1 ; 137.46,74.08 137.21,74.08
  Bottom Layer w0.254: v1(123.49,62.1) 134.53,62.1 v1(134.63,62.2) 136.39,62.2 137.28,63.09 v1(137.28,66.7)
PA1: length 20.1
  Top Layer w0.152: R9.1 151.43,57.27 ; U1.9 157.65,44.39 v1(155.77,44.39)
  Top Layer w0.254: U1.9 R21.1
  Bottom Layer w0.152: v1(151.43,57.27) 151.43,55.88 151.48,55.82 151.5,55.82 154.3,53.03 154.3,48.61 155.77,47.14 v1(155.77,44.39)
PRX: length 173.8
  Top Layer w0.152: v1(139.59,67.03) 147.19,67.03 v1(148.66,68.5) ; v1(149.04,73.07) 149.06,73.07 ; v1(136.24,34.39) 129.79,34.39 122.7,27.3 47.9,27.3 47.74,27.15 27.6,27.15 24.11,30.64 24.11,34.33
  Top Layer w0.254: U16.2 149.53,72.61 149.04,73.1 149.04,74.94 R35.1
  Bottom Layer w0.152: v1(139.59,67.03) 138.24,65.68 138.24,62.07 136.24,60.07 v1(136.24,34.39) ; v1(148.66,68.5) 148.66,72.69 v1(149.04,73.07)
RGB: length 148.7
  Top Layer w0.203: 22.84,52.33 22.95,52.44 22.95,53.23 23.56,53.84 33.88,53.84 v1(34.87,54.83) ; v1(92.88,4.14) 92.88,3.17 94.33,1.72 103.07,1.72 103.86,2.51 LED3.4
  Bottom Layer w0.203: v1(92.88,4.14) 92.88,56.08 87.62,61.34 45.74,61.34 42.46,64.61 38.88,64.61 35.37,61.11 35.37,55.29 34.92,54.83 v1(34.87,54.83)
RLY: length 53.7
  Top Layer w0.152: 11.41,34.33 11.41,33.53 22.85,22.09 22.85,12.72 24.73,10.84 38.6,10.84 42.26,7.18 R42.2
SD_CLK: length 32
  Top Layer w0.152: R50.2 30.66,16.77 CARD1.5 30.66,13.8 29.1,12.24 v1(28.36,12.24) ; 22.84,34.33 22.8,34.29 v1(22.8,32.84)
  Bottom Layer w0.152: v1(28.36,12.24) 23.59,17.01 23.59,32.05 v1(22.8,32.84)
SD_MISO: length 40.7
  Top Layer w0.152: v1(28.03,49.07) 25.63,49.07 25.61,49.04 ; R48.2 28.44,18.63 v1(28.44,16.38) 28.46,16.36 CARD1.7
  Bottom Layer w0.152: v1(28.44,16.38) 28.03,16.78 v1(28.03,49.07)
SD_MOSI: length 40
  Top Layer w0.152: v1(28.59,47.75) 28.57,47.77 25.61,47.77 ; CARD1.3 32.86,16.2 v1(32.78,16.28) 33.92,17.41 R51.2
  Bottom Layer w0.152: v1(28.59,47.75) 28.59,20.47 32.78,16.28
SD_SS: length 33.9
  Top Layer w0.152: 25.61,38.88 25.66,38.83 v1(29.25,38.83) ; 33.96,14.67 33.96,16.25 v1(33.93,16.28) 34.84,17.19 34.84,18.71 R52.2
  Bottom Layer w0.152: v1(29.25,38.83) 29.25,20.96 v1(33.93,16.28)
TFT_CLK: length 51
  Top Layer w0.203: 17.76,52.33 17.76,53.45 20.82,56.51 v1(36.42,56.51) 37.76,55.16 37.76,31.34 40.76,28.34
TFT_CS: length 26.1
  Top Layer w0.203: v1(35.4,43.51) 34.56,43.51 27.83,50.24 19.97,50.24 19.03,51.18 19.03,52.33
  Bottom Layer w0.203: v1(35.4,43.51) 40.69,43.51 40.76,43.58
TFT_MISO: length 51.1
  Top Layer w0.203: 40.76,30.88 38.3,33.35 38.3,55.6 v1(36.47,57.42) 36.44,57.4 20.41,57.4 16.49,53.48 16.49,52.33
TFT_MOSI: length 69
  Top Layer w0.203: 40.76,35.96 43.2,38.4 43.2,63.01 42.54,63.67 39.26,63.67 33.88,58.29 19.88,58.29 v1(19.75,58.16) ; 8.87,52.33 8.87,54.92 ; 8.87,54.92 10.82,54.92 v1(10.84,54.94) ; 8.87,54.92 8.86,54.94
  Bottom Layer w0.203: v1(19.75,58.16) 19.63,58.29 14.19,58.29 v1(10.84,54.94)
TFT_RS: length 49.8
  Top Layer w0.203: 15.22,34.33 15.22,33.18 26.3,22.09 v1(39.62,22.09)
  Bottom Layer w0.203: 40.76,38.5 42.13,38.5 43.2,37.44 43.2,25.8 39.62,22.22 v1(39.62,22.09)
TFT_RST: length 54.7
  Top Layer w0.203: 13.95,34.33 13.95,33.18 25.72,21.41 39.49,21.41 v1(39.64,21.26)
  Bottom Layer w0.203: 40.76,41.04 43.91,37.89 43.91,25.4 39.77,21.26 v1(39.64,21.26)
USB_5V: length 26.8
  Top Layer w0.152: 9.39,73.6 9.75,73.25 R14.2
  Top Layer w0.305: USBC1.B4 6.61,74.25 6.47,74.39 6.39,74.39 5.63,75.15 5.63,77.77 6.61,78.75 6.61,78.75 USBC1.B9 ; 9.39,73.6 8.83,73.6 8.49,73.95 USBC1.A9
  Top Layer w1: PSW1.3 8.06,90.4 10.74,87.73 ; 9.48,79.33 10.74,80.59
  Top Layer w1.5: 10.74,80.59 10.74,87.73
USB_D+: length 24.1
  Top Layer w0.203: USBC1.A6 6.53,76.75 6.34,76.56 6.34,75.99 6.58,75.75 USBC1.B6 12.48,75.75 13.02,75.2 13.02,71.6 14.17,70.46 16.98,70.46 17.85,71.32 17.85,74.57 16.29,76.13 15.55,76.13
USB_D-: length 24.3
  Top Layer w0.203: 15.55,74.86 16.91,74.86 17.44,74.32 17.44,71.45 16.8,70.81 14.32,70.81 13.5,71.62 13.5,75.43 12.69,76.25 arc(12.51,76.32) 12.43,76.5 12.43,76.63 arc(12.18,76.88) 11.93,76.63 11.93,76.5 arc(11.67,76.25) 11.42,76.5 11.42,76.63 arc(11.16,76.88) 10.91,76.63 10.91,76.5 arc(10.66,76.25) 10.4,76.5 10.4,76.63 arc(10.15,76.88) 9.89,76.63 9.89,76.5 arc(9.82,76.32) 9.64,76.25 8.08,76.25 8.37,76.54 8.37,77.02 8.14,77.25 USBC1.B7
  Top Layer w0.305: USBC1.A7 8.08,76.25

## Copper pours and planes (outline as drawn; the poured copper is in the pictures)
3.3V on Top Layer: 12.54,29.38 15.05,29.38 15.05,26.89 12.54,26.89
3.3V on Top Layer: 32.22,88.39 38.55,88.39 38.55,75.64 32.22,75.64
3.3V on Bottom Layer: 32.22,88.39 134.59,88.39 134.59,69.06 32.22,69.06
3.3V on Bottom Layer: 12.54,29.38 15.05,29.38 15.05,26.89 12.54,26.89
5V on Top Layer: 20.82,96.62 134.56,96.62 134.56,67.92 20.82,67.92
GND on Top Layer: 11.24,46.83 20.74,46.83 20.74,37.66 11.24,37.66
GND on Top Layer: 0.45,84.65 8.68,84.65 8.68,69.36 0.45,69.36
GND on Top Layer: 24.63,114.07 31.11,114.07 31.11,105.13 24.63,105.13
GND on Top Layer: 33.82,110.97 56.28,110.97 56.28,78.15 33.82,78.15
GND on Top Layer: 5.46,124.5 37.49,124.5 37.49,102.61 5.46,102.61
GND on Top Layer: 125.7,121.81 132.3,121.81 132.3,81.86 125.7,81.86
VIN_5V on Top Layer: 19.37,101.42 33.09,101.42 33.09,97.23 19.37,97.23
$C3_1 on Top Layer: 33.8,98.17 42.84,98.17 42.84,92.17 33.8,92.17
$C6_2 on Top Layer: 12.74,114.07 24.45,114.07 24.45,104.9 12.74,104.9
$C12_2 on Top Layer: 45.48,102.08 52.55,102.08 52.55,97.6 45.48,97.6
$C17_1 on Top Layer: 24.43,118.63 29.63,118.63 29.63,112.74 24.43,112.74
$C17_2 on Top Layer: 26.19,119.99 29.13,119.99 29.13,119.15 26.19,119.15
$D3_2 on Top Layer: 36.92,107.13 42.56,107.13 42.56,99.84 36.92,99.84
$R16_1 on Top Layer: 25.06,118.61 27.37,118.61 27.37,115.21 25.06,115.21
BAT+ on Top Layer: 57.4,122.4 65.42,122.4 65.42,79.98 57.4,79.98
BAT+ on Top Layer: 42.74,110.94 46.47,110.94 46.47,99.89 42.74,99.89
DC_5V on Top Layer: 31.51,116.15 36.82,116.15 36.82,102.23 31.51,102.23
USB_5V on Top Layer: 3.6,90.93 11.47,90.93 11.47,87.22 3.6,87.22
USB_5V on Top Layer: 6.61,81.18 11.36,81.18 11.36,78.6 6.61,78.6

## Text on the board
Top Silkscreen Layer: GND | 5-16Vin | 5Vo | 3.3V | V2.2 | ESP32-Gateway
